# Altium schematic sheet Microcontroller.SchDoc
size A4; SheetNumber: 5; SheetTotal: 5
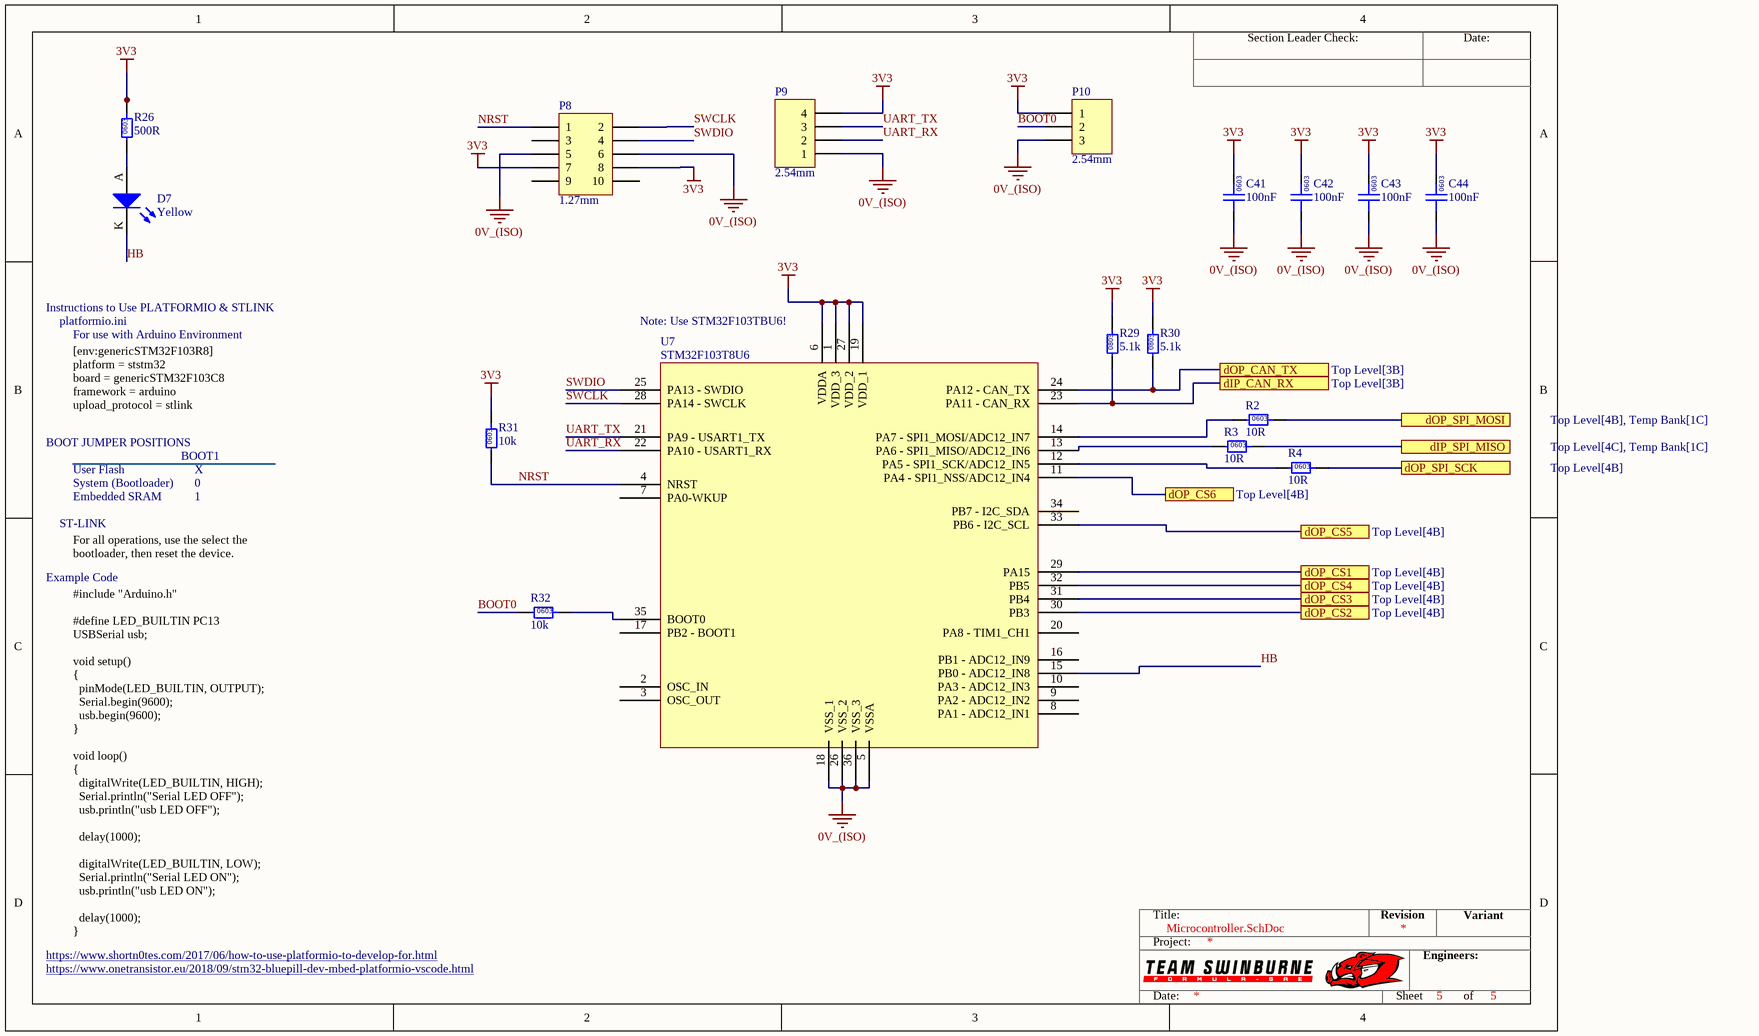
[diagram p0: Microcontroller.SchDoc]

## Parts
C41  100nF  [0603]
C42  100nF  [0603]
C43  100nF  [0603]
C44  100nF  [0603]
D7  Yellow  [0805 LED]
P8  1.27mm  [3221-10-0300-00]
P9  2.54mm  [TH 2.54mm Header 1x4]
P10  2.54mm  [TH 2.54mm Header 1x3]
R2  10R  [0603]
R3  10R  [0603]
R4  10R  [0603]
R26  500R  [0603]
R29  5.1k  [0805]
R30  5.1k  [0805]
R31  10k  [0603]
R32  10k  [0603]
U7  STM32F103T8U6  [STM_QFN-36]

## Ports
dIP_CAN_RX (see Top Level[3B]), dIP_SPI_MISO (see Top Level[4C], Temp Bank[1C]), dOP_CAN_TX (see Top Level[3B]), dOP_CS1 (see Top Level[4B]), dOP_CS2 (see Top Level[4B]), dOP_CS3 (see Top Level[4B]), dOP_CS4 (see Top Level[4B]), dOP_CS5 (see Top Level[4B]), dOP_CS6 (see Top Level[4B]), dOP_SPI_MOSI (see Top Level[4B], Temp Bank[1C]), dOP_SPI_SCK (see Top Level[4B])

## Nets
0V_(ISO): C41.1 C42.1 C43.1 C44.1 P8.5 P8.6 P9.1 P10.3 U7.5(VSSA) U7.18(VSS_1) U7.26(VSS_2) U7.36(VSS_3)
3V3: C41.2 C42.2 C43.2 C44.2 P8.7 P8.8 P9.4 P10.1 R26.2 R29.2 R30.2 R31.2 U7.1(VDD_3) U7.6(VDDA) U7.19(VDD_1) U7.27(VDD_2)
BOOT0: P10.2 R32.1
dIP_CAN_RX: R29.1 U7.23(PA11_-_CAN_RX) ; port dIP_CAN_RX
dIP_SPI_MISO: R3.2 ; port dIP_SPI_MISO
dOP_CAN_TX: R30.1 U7.24(PA12_-_CAN_TX) ; port dOP_CAN_TX
dOP_CS1: U7.29(PA15) ; port dOP_CS1
dOP_CS2: U7.30(PB3) ; port dOP_CS2
dOP_CS3: U7.31(PB4) ; port dOP_CS3
dOP_CS4: U7.32(PB5) ; port dOP_CS4
dOP_CS5: U7.33(PB6_-_I2C_SCL) ; port dOP_CS5
dOP_CS6: U7.11(PA4_-_SPI1_NSS/ADC12_IN4) ; port dOP_CS6
dOP_SPI_MOSI: R2.2 ; port dOP_SPI_MOSI
dOP_SPI_SCK: R4.2 ; port dOP_SPI_SCK
HB: D7.K U7.15(PB0_-_ADC12_IN8)
NRST: P8.1 R31.1 U7.4(NRST)
SWCLK: P8.2 U7.28(PA14_-_SWCLK)
SWDIO: P8.4 U7.25(PA13_-_SWDIO)
UART_RX: P9.2 U7.22(PA10_-_USART1_RX)
UART_TX: P9.3 U7.21(PA9_-_USART1_TX)
NetD7_A: D7.A R26.1
NetR2_1: R2.1 U7.14(PA7_-_SPI1_MOSI/ADC12_IN7)
NetR3_1: R3.1 U7.13(PA6_-_SPI1_MISO/ADC12_IN6)
NetR4_1: R4.1 U7.12(PA5_-_SPI1_SCK/ADC12_IN5)
NetR32_2: R32.2 U7.35(BOOT0)

Not connected (* = marked no-connect by the designer): P8 3 9 10; U7 2(OSC_IN) 3(OSC_OUT) 7(PA0-WKUP) 8(PA1_-_ADC12_IN1) 9(PA2_-_ADC12_IN2) 10(PA3_-_ADC12_IN3) 16(PB1_-_ADC12_IN9) 17(PB2_-_BOOT1_) 20(PA8_-_TIM1_CH1) 34(PB7_-_I2C_SDA)

## Notes on the sheet
- Instructions to Use PLATFORMIO & STLINK
- platformio.ini
- For use with Arduino Environment
- (near U7) Note: Use STM32F103TBU6!
- BOOT JUMPER POSITIONS
- [env:genericSTM32F103R8]
  platform = ststm32
  board = genericSTM32F103C8
  framework = arduino
  upload_protocol = stlink
- User Flash
- System (Bootloader)
- Embedded SRAM
- BOOT1
- X
- 1
- 0
- Example Code
- ST-LINK
- For all operations, use the select the bootloader, then reset the device.
- https://www.shortn0tes.com/2017/06/how-to-use-platformio-to-develop-for.html
- https://www.onetransistor.eu/2018/09/stm32-bluepill-dev-mbed-platformio-vscode.html
- #include "Arduino.h"
  #define LED_BUILTIN PC13
  USBSerial usb;
  void setup()
  {
  pinMode(LED_BUILTIN, OUTPUT);
  Serial.begin(9600);
  usb.begin(9600);
  }
  void loop()
  {
  digitalWrite(LED_BUILTIN, HIGH);
  Serial.println("Serial LED OFF");
  usb.println("usb LED OFF");
  delay(1000);
  digitalWrite(LED_BUILTIN, LOW);
  Serial.println("Serial LED ON");
  usb.println("usb LED ON");
  delay(1000);
  }
- Section Leader Check:
- Date:
- Title:
- Revision
- Variant
- Project:
- Engineers:
- Sheet
- of
- (in symbol GCM188L81H104KA57D) 0603
- (in symbol RC0603FR-0710KL) 0603
- (in symbol RC0603FR-0710RL) 0603
- (in symbol RC0805FR075K1L) 0805
- (in symbol RT0603BRD07500RL) 0603

## Library data of the parts
C41-C44 = GCM188L81H104KA57D: Manufacturer: muRata; Rated Voltage: 50V; Tolerance: ±10%; Material: MLCC; Temperature Rating: X8L; Part Number: GCM188L81H104KA57D; Value: 100nF; Digikey Part Number: 490-6049-1-ND
D7 = SML-211YTT86: Yellow LED Indication - Discrete 1.75V 0805 (2012 Metric); Manufacturer: ROHM Semiconductor; Part Number: SML-211YTT86; Colour: Yellow; Digikey Part Number: 511-1293-1-ND
P8 = SMD 1.27mm Header 2x5 (3221-10-0300-00): Positions: 10; Angle: 0; Flange: No; Contact: NA; Part Number: SMD 1.27mm Header 2x5 (3221-10-0300-00); Pitch: 1.27mm; Row Spacing: 1.27mm
P9 = TH 2.54mm Header 1x4: Positions: 4; Angle: 0; Flange: No; Contact: NA; Part Number: TH 2.54mm Header 1x4; Pitch: 2.54mm; Row Spacing: 2.54mm
P10 = TH 2.54mm Header 1x3: Positions: 3; Angle: 0; Flange: No; Contact: NA; Part Number: TH 2.54mm Header 1x3; Pitch: 2.54mm; Row Spacing: 2.54mm
R2-R4 = RC0603FR-0710RL: Manufacturer: YAGEO; Tolerance: 0.01; Rated Power: 0.1W; Part Number: RC0603FR-0710RL; Value: 10R; Material: FR-07; Digikey Part Number: 311-10.0HRCT-ND
R26 = RT0603BRD07500RL: Manufacturer: YAGEO; Tolerance: 0.01; Rated Power: 0.1W; Part Number: RT0603BRD07500RL; Value: 500R; Material: FR-07; Digikey Part Number: 13-RT0603BRD07500RL-ND
R29 R30 = RC0805FR075K1L: Manufacturer: YAGEO; Tolerance: 0.01; Rated Power: 0.125W; Part Number: RC0805FR075K1L; Value: 5.1k; Material: FR-07; Digikey Part Number: 311-5.10KCRCT-ND
R31 R32 = RC0603FR-0710KL: Manufacturer: YAGEO; Tolerance: 0.01; Rated Power: 0.1W; Part Number: RC0603FR-0710KL; Value: 10k; Digikey Part Number: 311-10.0KHRCT-ND; Material: FR-07
U7 = STM32F103T8U6: ARM® Cortex®-M3 STM32F1 Microcontroller IC 32-Bit 72MHz 64KB (64K x 8) FLASH QFN; Manufacturer: ST Microelectronics; Part Number: STM32F103T8U6; Digikey Part Number: STM32F103T8U6; Digikey Link: https://www.digikey.com/en/products/detail/stmicroelectronics/stm32f103t8u6/1852493